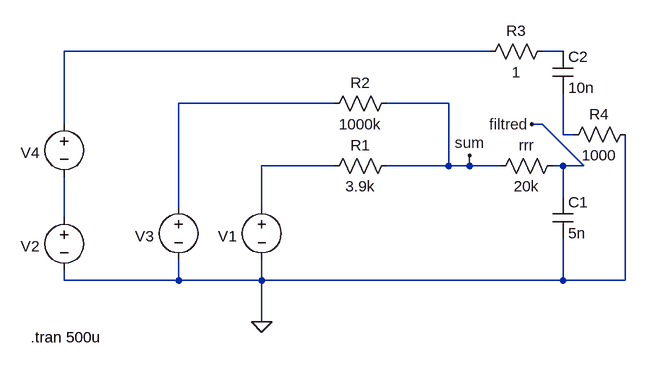
[diagram p0: schematic Draft2.asc]
Draft2.asc, the LTspice schematic file:
Version 4
SHEET 1 880 680
WIRE 336 -80 -320 -80
WIRE 448 -80 416 -80
WIRE 96 0 -144 0
WIRE 272 0 176 0
WIRE -320 32 -320 -80
WIRE 416 32 400 32
WIRE 448 48 448 -16
WIRE 464 48 448 48
WIRE 96 96 -16 96
WIRE 272 96 272 0
WIRE 272 96 176 96
WIRE 304 96 304 80
WIRE 304 96 272 96
WIRE 352 96 304 96
WIRE 448 96 432 96
WIRE 480 96 416 32
WIRE 480 96 448 96
WIRE 448 144 448 96
WIRE -144 160 -144 0
WIRE -16 160 -16 96
WIRE -320 176 -320 112
WIRE -320 272 -320 256
WIRE -144 272 -144 240
WIRE -144 272 -320 272
WIRE -16 272 -16 240
WIRE -16 272 -144 272
WIRE 448 272 448 208
WIRE 448 272 -16 272
WIRE 544 272 544 48
WIRE 544 272 448 272
WIRE -16 336 -16 272
FLAG -16 336 0
FLAG 304 80 sum
FLAG 400 32 filtred
SYMBOL voltage -16 144 R0
WINDOW 0 -67 60 Left 2
WINDOW 3 24 96 Invisible 2
WINDOW 123 0 0 Left 2
WINDOW 39 0 0 Left 2
SYMATTR InstName V1
SYMATTR Value PULSE(0 256 0 0 0 0.5u 1u)
SYMBOL res 80 112 R270
WINDOW 0 32 56 VTop 2
WINDOW 3 0 56 VBottom 2
SYMATTR InstName R1
SYMATTR Value 3.9k
SYMBOL voltage -144 144 R0
WINDOW 0 -67 60 Left 2
WINDOW 3 24 96 Invisible 2
WINDOW 123 0 0 Left 2
WINDOW 39 0 0 Left 2
SYMATTR InstName V3
SYMATTR Value PULSE(0 256 0 0 0 0.5u 1u)
SYMBOL res 80 16 R270
WINDOW 0 32 56 VTop 2
WINDOW 3 0 56 VBottom 2
SYMATTR InstName R2
SYMATTR Value 1000k
SYMBOL res 336 112 R270
WINDOW 0 32 56 VTop 2
WINDOW 3 0 56 VBottom 2
SYMATTR InstName rrr
SYMATTR Value 20k
SYMBOL cap 432 144 R0
SYMATTR InstName C1
SYMATTR Value 5n
SYMBOL voltage -320 160 R0
WINDOW 0 -67 60 Left 2
WINDOW 3 24 96 Invisible 2
WINDOW 123 0 0 Left 2
WINDOW 39 0 0 Left 2
SYMATTR InstName V2
SYMATTR Value 100
SYMBOL res 320 -64 R270
WINDOW 0 32 56 VTop 2
WINDOW 3 0 56 VBottom 2
SYMATTR InstName R3
SYMATTR Value 1
SYMBOL cap 432 -80 R0
SYMATTR InstName C2
SYMATTR Value 10n
SYMBOL voltage -320 16 R0
WINDOW 0 -67 60 Left 2
WINDOW 3 24 96 Invisible 2
WINDOW 123 0 0 Left 2
WINDOW 39 0 0 Left 2
SYMATTR InstName V4
SYMATTR Value SINE(0 10 100000 0 0 0 0)
SYMBOL res 448 64 R270
WINDOW 0 32 56 VTop 2
WINDOW 3 0 56 VBottom 2
SYMATTR InstName R4
SYMATTR Value 1000
TEXT -372 360 Left 2 !.tran 500u

The netlist it stands for:
* Draft2.asc
V1 N005 0 PULSE(0 256 0 0 0 0.5u 1u)
R1 N005 sum 3.9k
V3 N003 0 PULSE(0 256 0 0 0 0.5u 1u)
R2 N003 sum 1000k
rrr sum filtred 20k
C1 filtred 0 5n
V2 N006 0 100
R3 N001 N002 1
C2 N002 N004 10n
V4 N001 N006 SINE(0 10 100000 0 0 0 0)
R4 N004 0 1000
.tran 500u
.backanno
.end